# Altium schematic sheet LED.SchDoc
size A4
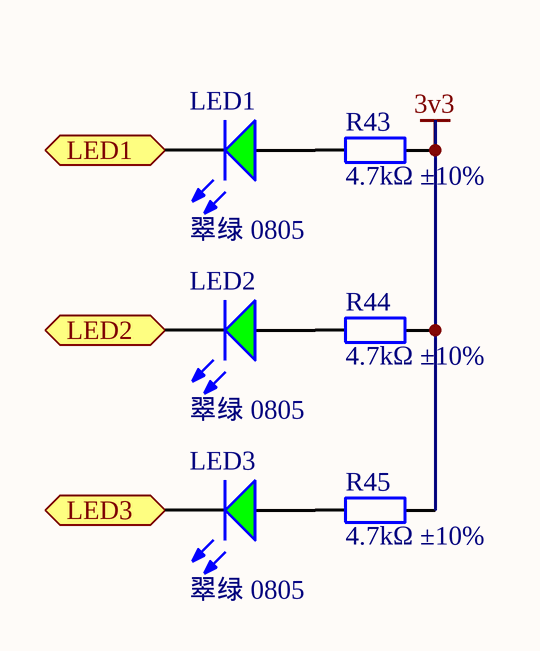
[diagram p0: LED.SchDoc]

## Parts
LED1  翠绿 0805  [0805_LED_S1]
LED2  翠绿 0805  [0805_LED_S1]
LED3  翠绿 0805  [0805_LED_S1]
R43  4.7kΩ ±10%  [0603_R]
R44  4.7kΩ ±10%  [0603_R]
R45  4.7kΩ ±10%  [0603_R]

## Ports
LED1 (in), LED2 (in), LED3 (in)

## Nets
3v3: R43.2 R44.2 R45.2
LED1: LED1.K ; port LED1
LED2: LED2.K ; port LED2
LED3: LED3.K ; port LED3
NetLED1_A: LED1.A R43.1
NetLED2_A: LED2.A R44.1
NetLED3_A: LED3.A R45.1

## Library data of the parts
LED1-LED3 = 0805 翠绿: 发光二极管; ComponentLink1Description: 供应商链接; ComponentLink1URL: http://www.szlcsc.com/product/details_2670.html; Package: 0805; Supplier: LC; SuppliersPartNumber: C2297
R43-R45 = 0603 2.2Ω (2R20) 1%: 贴片电阻; ComponentLink1Description: 供应商链接; ComponentLink1URL: http://www.szlcsc.com/product/details_23666.html; Package: 0603; Supplier: LC; SuppliersPartNumber: C22939